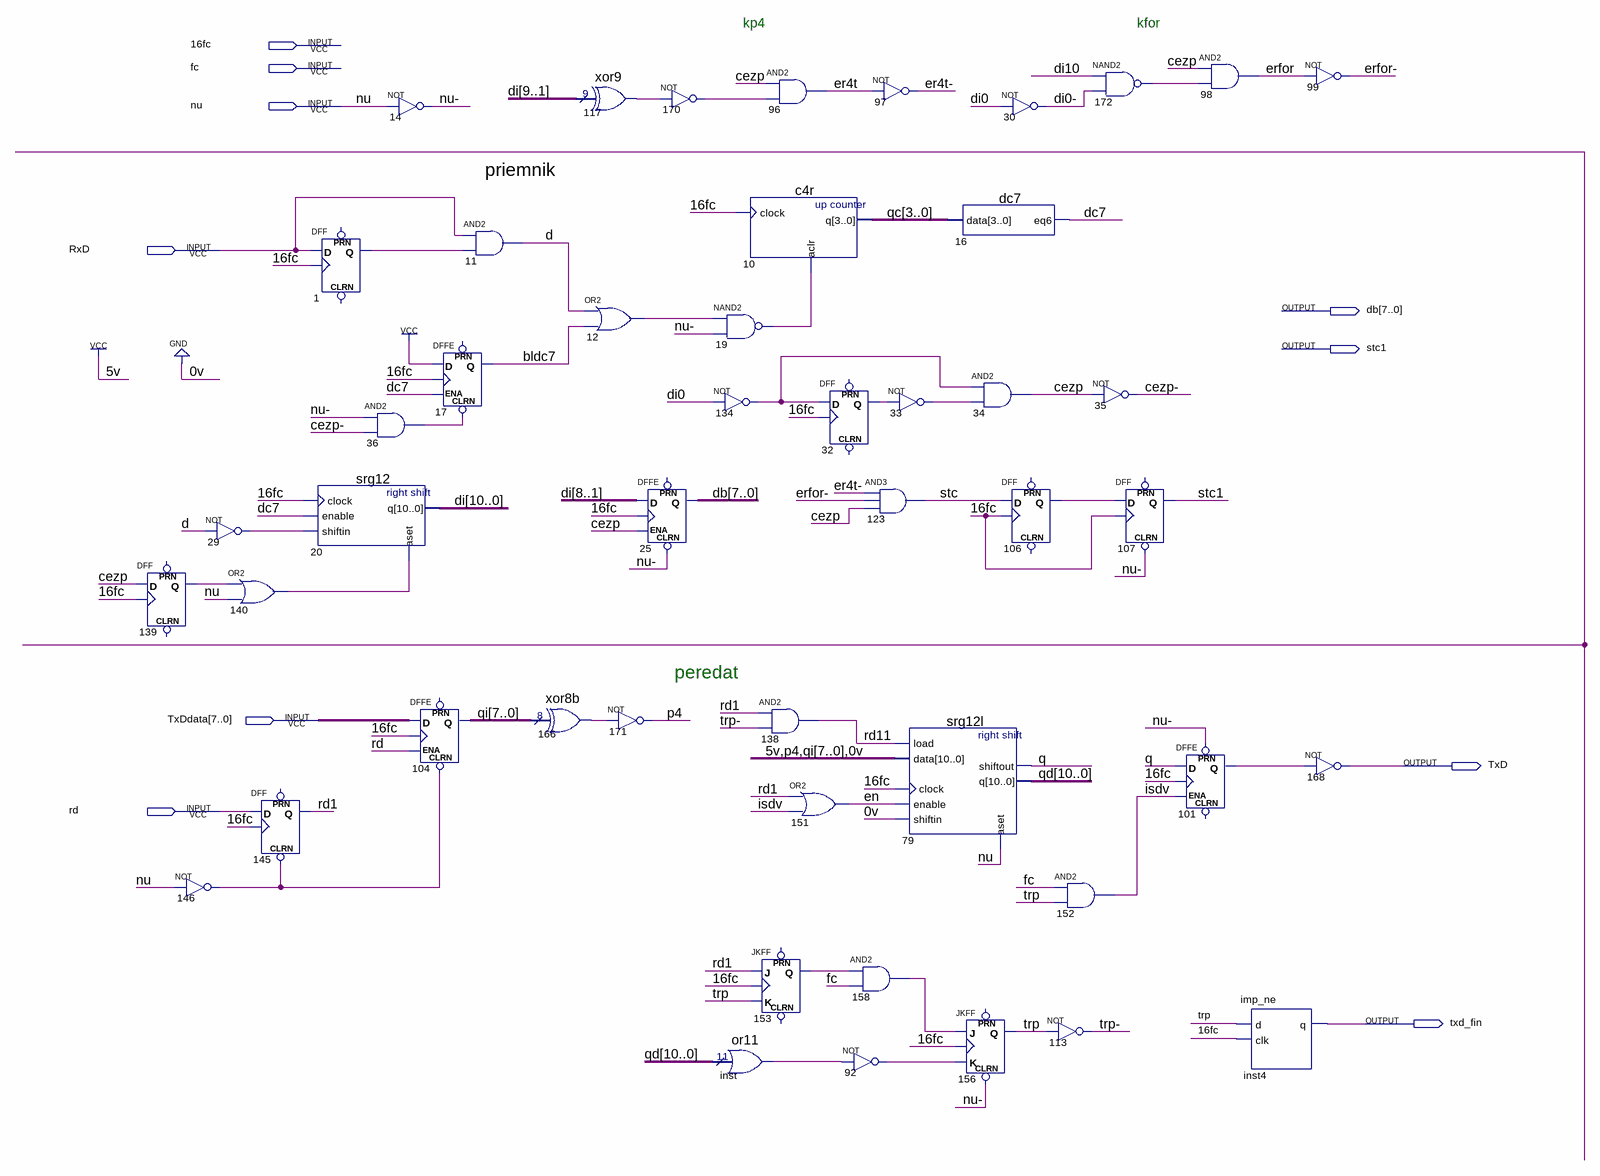
[diagram p0: schematic sheet]
// Quartus schematic comportm1.bdf as structural Verilog: 48 symbols, 10 pins
module comportm1 (
  input  \16fc ,
  input  fc,
  input  nu,
  input  RxD,
  input  [7:0] TxDdata,
  input  rd,
  output [7:0] db,
  output stc1,
  output TxD,
  output txd_fin
);

  wire bldc7, cezp, \cezp- , d, dc7, \di0- , en, er4t, \er4t- , erfor, \erfor- , inst_result, isdv, n1_q,
       n12_out, n19_out, n29_out, n32_q, n33_out, n36_out, n92_out, n101_q, n106_q, n117_result, n134_out,
       n139_q, n140_out, n146_out, n153_q, n158_out, n166_result, n170_out, n172_out, \nu- , p4, q, rd1,
       rd11, stc, trp, \trp- ;
  wire [3:0] qc;
  wire [7:0] qi;
  wire [10:0] di, qd;

  DFF u_139 (.CLK(\16fc ), .D(cezp), .Q(n139_q));  // open: CLRN, PRN
  not u_146 (n146_out, nu);
  not u_29 (n29_out, d);
  or u_140 (n140_out, n139_q, nu);
  DFF u_145 (.CLRN(n146_out), .CLK(\16fc ), .D(rd), .Q(rd1));  // open: PRN
  DFF u_1 (.CLK(\16fc ), .D(RxD), .Q(n1_q));  // open: CLRN, PRN
  srg12 u_20 (.clock(\16fc ), .enable(dc7), .shiftin(n29_out), .aset(n140_out), .q(di));
  and u_36 (n36_out, \nu- , \cezp- );
  not u_14 (\nu- , nu);
  DFFE u_17 (.CLRN(n36_out), .D(1'b1), .CLK(\16fc ), .ENA(dc7), .Q(bldc7));  // open: PRN
  DFFE u_104[7:0] (.CLRN(n146_out), .D(TxDdata), .CLK(\16fc ), .ENA(rd), .Q(qi));  // open: PRN
  and u_11 (d, RxD, n1_q);
  xor8b u_166 (.data(qi), .result(n166_result));
  xor9 u_117 (.data(di[9:1]), .result(n117_result));
  or u_12 (n12_out, d, bldc7);
  not u_171 (p4, n166_result);
  not u_170 (n170_out, n117_result);
  DFFE u_25[7:0] (.CLRN(\nu- ), .D(di[8:1]), .CLK(\16fc ), .ENA(cezp), .Q(db));  // open: PRN
  c4r u_10 (.clock(\16fc ), .aclr(n19_out), .q(qc));
  nand u_19 (n19_out, n12_out, \nu- );
  not u_134 (n134_out, di[0]);
  or11 inst (.data(qd), .result(inst_result));
  and u_96 (er4t, cezp, n170_out);
  and u_138 (rd11, rd1, \trp- );
  or u_151 (en, rd1, isdv);
  JKFF u_153 (.K(trp), .J(rd1), .CLK(\16fc ), .Q(n153_q));  // open: PRN, CLRN
  DFF u_32 (.CLK(\16fc ), .D(n134_out), .Q(n32_q));  // open: CLRN, PRN
  and u_158 (n158_out, n153_q, fc);
  not u_92 (n92_out, inst_result);
  not u_97 (\er4t- , er4t);
  not u_33 (n33_out, n32_q);
  and u_123 (stc, \er4t- , \erfor- , cezp);
  srg12l u_79 (
    .load(rd11), .data({1'b1, p4, qi, 1'b0}), .clock(\16fc ), .enable(en), .shiftin(1'b0), .aset(nu),
    .shiftout(q), .q(qd));
  dc7 u_16 (.data(qc), .eq6(dc7));
  and u_34 (cezp, n134_out, n33_out);
  JKFF u_156 (.CLRN(\nu- ), .K(n92_out), .J(n158_out), .CLK(\16fc ), .Q(trp));  // open: PRN
  not u_30 (\di0- , di[0]);
  DFF u_106 (.CLK(\16fc ), .D(stc), .Q(n106_q));  // open: CLRN, PRN
  nand u_172 (n172_out, di[10], \di0- );
  not u_35 (\cezp- , cezp);
  and u_152 (isdv, fc, trp);
  not u_113 (\trp- , trp);
  DFF u_107 (.CLRN(\nu- ), .CLK(\16fc ), .D(n106_q), .Q(stc1));  // open: PRN
  and u_98 (erfor, cezp, n172_out);
  DFFE u_101 (.PRN(\nu- ), .D(q), .CLK(\16fc ), .ENA(isdv), .Q(n101_q));  // open: CLRN
  imp_ne inst4 (.d(trp), .clk(\16fc ), .q(txd_fin));
  not u_99 (\erfor- , erfor);
  not u_168 (TxD, n101_q);

  // Notes on the sheet:
  //   kp4
  //   kfor
  //   peredat
endmodule
